# EAGLE design Linear_VCA_chip_v1.1 (EAGLE 7.7.0)
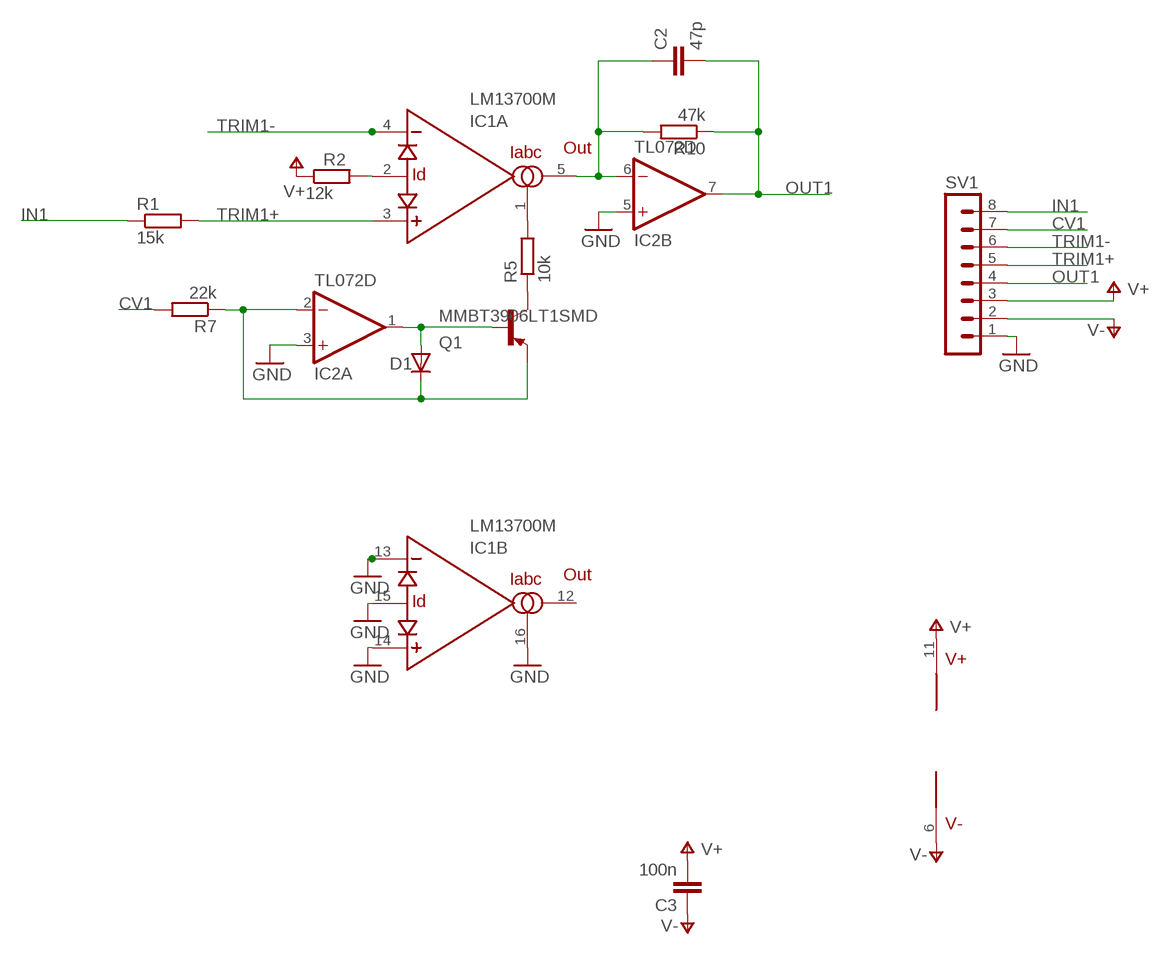
[diagram p0: schematic, sheet 1]

## Parts
C2  47p  C-EUC0805  [C0805]
C3  100n  C-EUC0805  [C0805]
D1  DIODE-SOD80C  [SOD80C]
IC1  LM13700M  [SO16]
IC2  TL072D  [SO08]
Q1  MMBT3906LT1SMD  [SOT23-BEC]
R1  15k  R-EU_R0805  [R0805]
R2  12k  R-EU_R0805  [R0805]
R5  10k  R-EU_R0805  [R0805]
R7  22k  R-EU_R0805  [R0805]
R10  47k  R-EU_R0805  [R0805]
SV1  MA08-1  [MA08-1]

## Nets
CV1: R7.2 SV1.7
GND: IC1.13(B:-IN) IC1.14(B:+IN) IC1.15(B:ID) IC1.16(B:IABC) IC2.3(A:+IN) IC2.5(B:+IN) SV1.1
IN1: R1.1 SV1.8
N$1: Q1.C R5.1
N$3: D1.C IC2.2(A:-IN) Q1.E R7.1
N$4: IC1.1(A:IABC) R5.2
N$6: IC1.2(A:ID) R2.2
N$9: C2.1 IC1.5(A:OUT) IC2.6(B:-IN) R10.2
N$10: D1.A IC2.1(A:OUT) Q1.B
OUT1: C2.2 IC2.7(B:OUT) R10.1 SV1.4
TRIM1+: IC1.3(A:+IN) R1.2 SV1.5
TRIM1-: IC1.4(A:-IN) SV1.6
V+: C3.2 IC1.11(V+) R2.1 SV1.3
V-: C3.1 IC1.6(V-) SV1.2
Unconnected: IC1.7(IN) IC1.8(OUT) IC1.9(OUT) IC1.10(IN) IC1.12(B:OUT)

## Power pins joined to a net without a drawn wire
V+: IC2.8(P:V+)
V-: IC2.4(P:V-)

## Library data of the parts
C2 C3 = resistor:C-EU: CAPACITOR, European symbol
D1 = diode:DIODE-: DIODE
IC1 = synthdiy:LM13700: National Dual OTA with buffers.
IC2 = linear:TL072: OP AMP
Q1 = transistor-pnp:MMBT3906*: PNP Transistror
R1 R2 R5 R7 R10 = resistor:R-EU_: RESISTOR, European symbol
SV1 = con-lstb:MA08-1: PIN HEADER; OC_FARNELL: unknown; OC_NEWARK: unknown

## Board
v1.1: out1 was not connected to any output pin.
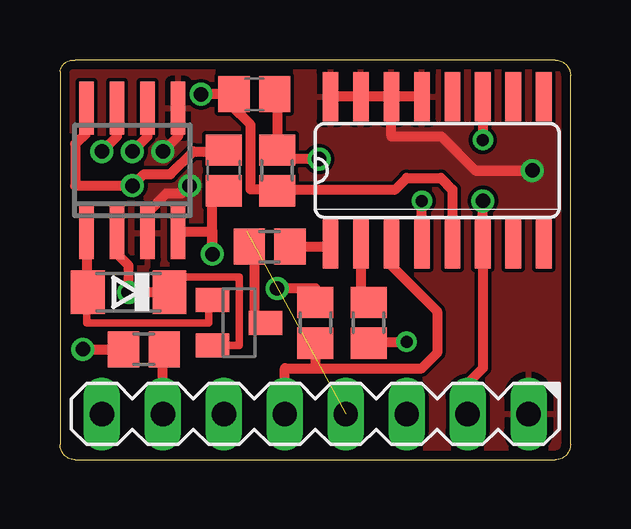
[diagram p1: board, top side]
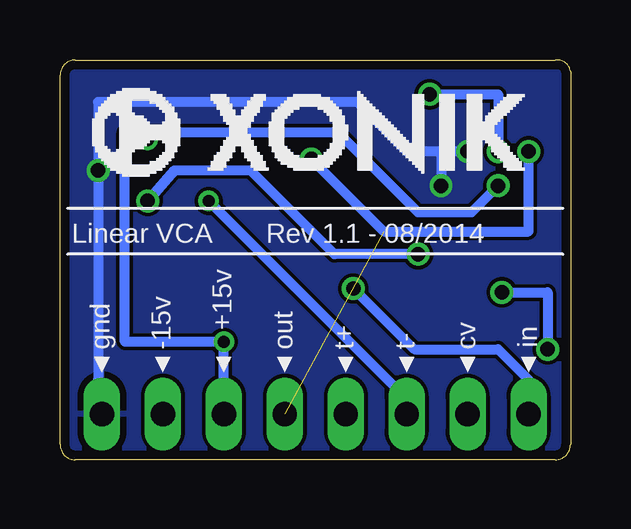
[diagram p2: board, bottom side, seen from below]

Size 21.27 x 16.67 mm. Coordinates in mm from the lower left corner, seen from the top.
Outline: 0.64,0 20.64,0 arc90 21.27,0.64 21.27,16.03 arc90 20.64,16.67 0.64,16.67 arc90 0,16.19 0,0.64 arc90 0.64,0
Copper layers (1*16): Top 0.0356mm / dielectric 1.5011mm / Bottom 0.0356mm
Design rules "default": minimum track width 6mil, minimum drill 13mil, track to track 6mil, track to pad 6mil, pad to pad 6mil, via to via 6mil, smd to smd 6mil, copper to edge 15mil, drill to drill 6mil, minimum pad ring 7mil, minimum via ring 7mil, stop-mask expansion 3mil, vias tented up to drill 0mil, thermal gap 10mil

### Footprints (pad centres in the part's own frame; a part is rotated, then mirrored left to right if it is on the bottom)
C0805 = smd 1.3 x 1.5: 1 -0.85,0; 2 0.85,0
SOD80C = smd 1.4 x 1.8: A 1.7,0; C -1.7,0
SO16 = smd 0.66 x 2.032: 1 -4.445,-3.073; 2 -3.175,-3.073; 3 -1.905,-3.073; 4 -0.635,-3.073; 5 0.635,-3.073; 6 1.905,-3.073; 7 3.175,-3.073; 8 4.445,-3.073; 9 4.445,3.073; 10 3.175,3.073; 11 1.905,3.073; 12 0.635,3.073; 13 -0.635,3.073; 14 -1.905,3.073; 15 -3.175,3.073; 16 -4.445,3.073
SO08 = smd 0.6 x 2.2: 1 -1.905,-2.6; 2 -0.635,-2.6; 3 0.635,-2.6; 4 1.905,-2.6; 5 1.905,2.6; 6 0.635,2.6; 7 -0.635,2.6; 8 -1.905,2.6
SOT23-BEC = smd 1 x 1.4: B -0.95,-1.1; C 0,1.1; E 0.95,-1.1
R0805 = smd 1.3 x 1.5: 1 -0.85,0; 2 0.85,0
MA08-1 = drill 1.016 long: 1 -8.89,0; 2 -6.35,0; 3 -3.81,0; 4 -1.27,0; 5 1.27,0; 6 3.81,0; 7 6.35,0; 8 8.89,0

### Placement (x,y rotation side)
C2  8.1,15.24 0 top
C3  6.83,12.06 90 top
D1  2.86,6.99 180 top
IC1  15.72,12.06 0 top
IC2  3.02,12.06 0 top
Q1  7.46,5.71 270 top
R1  10.64,5.71 270 top
R2  12.86,5.71 90 top
R5  8.73,8.89 0 top
R7  3.49,4.6 0 top
R10  9.05,12.06 270 top
SV1  10.64,1.91 180 top

### Tracks (layer width: path | path; a pad name or v marks a point on that pad's centre or on a via)
CV1
  Top 0.406: SV1.7 4.29,4.18 R7.2
GND  (via drill 0.6)
  Top 0.406: IC1.13 IC1.14 | IC1.14 IC1.15 IC1.16 | IC2.3 3.65,10.32 4.45,11.11 5.08,11.11 v5.4,11.43 | IC2.5 4.92,13.49 v4.29,12.86 | IC1.14 13.81,13.49 15.88,13.49 17.3,12.06 v19.68,12.06
  Bottom 0.406: v4.29,12.86 5.4,12.86 | 5.4,12.86 v5.4,11.43 | 5.4,12.86 6.83,12.86 8.89,14.92 19.68,14.92 v19.68,12.06 19.68,3.33 SV1.1
  pour Top: 0,16.67 21.27,16.67 21.27,0 0,0
  pour Bottom: 0,0 21.27,0 21.27,16.67 0,16.67
IN1  (via drill 0.6)
  Top 0.406: R1.1 10.64,7.14 v9.05,7.14
  Bottom 0.406: v9.05,7.14 6.51,4.6 3.02,4.6 1.75,3.33 SV1.8
N$1
  Top 0.406: R5.1 8.1,8.89 8.1,5.71 Q1.C
N$3  (via drill 0.6)
  Top 0.305: D1.C 4.72,7.1 4.92,7.3 4.92,7.62 7.46,7.62 7.46,4.76 Q1.E
  Top 0.406: D1.C v2.86,6.99 2.86,8.1 2.38,8.57 IC2.2 | v0.95,4.6 R7.1 2.22,4.6
  Bottom 0.406: v2.86,6.99 0.95,6.99 v0.95,4.6
N$4
  Top 0.406: R5.2 11.27,8.89 IC1.1
N$6
  Top 0.406: IC1.2 12.54,6.57 R2.2
N$9  (via drill 0.6)
  Top 0.406: v5.87,15.24 C2.1 7.14,15.18 7.14,14.76 7.94,13.97 7.94,11.27 9.05,11.27 | v3.02,12.86 3.65,13.49 IC2.6 | R10.2 9.05,11.27 | 9.05,11.27 13.97,11.27 14.45,11.75 15.88,11.75 16.35,11.27 IC1.5
  Bottom 0.406: v5.87,15.24 3.02,15.24 v3.02,12.86
N$10
  Top 0.305: Q1.B 6.36,6.52 6.19,6.35 6.19,5.71 1.11,5.71 1.11,6.99 D1.A
  Top 0.406: IC2.1 1.11,7.19 D1.A
OUT1  (via drill 0.6)  (1 unrouted)
  Top 0.406: v1.75,12.86 2.38,13.49 IC2.7 | C2.2 9.05,14.98 R10.1 9.31,13.18 9.37,12.54 v10.79,12.54
  Bottom 0.406: v1.75,12.86 1.75,9.53 7.78,9.53 v10.79,12.54
TRIM1+
  Top 0.406: IC1.3 13.81,8.1 15.72,6.19 15.72,4.45 15.08,3.81 10.64,3.81 | 10.64,3.81 9.37,3.81 SV1.5 | R1.2 10.64,3.81
TRIM1-  (via drill 0.5)
  Top 0.406: IC1.4 v15.08,10.79
  Bottom 0.406: v15.08,10.79 6.83,2.54 SV1.6
V+  (via drill 0.5, 0.6)
  Top 0.406: IC2.8 1.11,13.65 0.64,13.18 0.64,11.43 v3.02,11.43 3.49,11.91 4.6,11.91 5.56,12.86 6.67,12.86 6.72,13.02 C3.2 | IC1.11 v17.62,13.34 | R2.1 13.07,4.87 13.02,4.92 v14.45,4.92
  Bottom 0.406: SV1.3 v14.45,4.92 18.57,4.92 18.57,13.65 17.62,13.65 | v3.02,11.43 4.13,10.32 6.35,10.32 9.68,13.65 17.62,13.65 | 17.62,13.65 v17.62,13.34
V-  (via drill 0.6)
  Top 0.406: v17.62,10.79 IC1.6 17.62,3.81 16.99,3.17 SV1.2 | 6.83,10.79 C3.1 6.29,11.21 6.35,11.16 v6.35,8.57 6.35,9.53 4.92,9.53 IC2.4
  Bottom 0.406: v6.35,8.57 9.84,8.57 13.34,12.06 16.51,12.06 v17.62,10.79

### Text on the board
bNames: Rev 1.1 - 08/2014 | Linear VCA | in | cv | t- | t+ | out | +15v | -15v | gnd